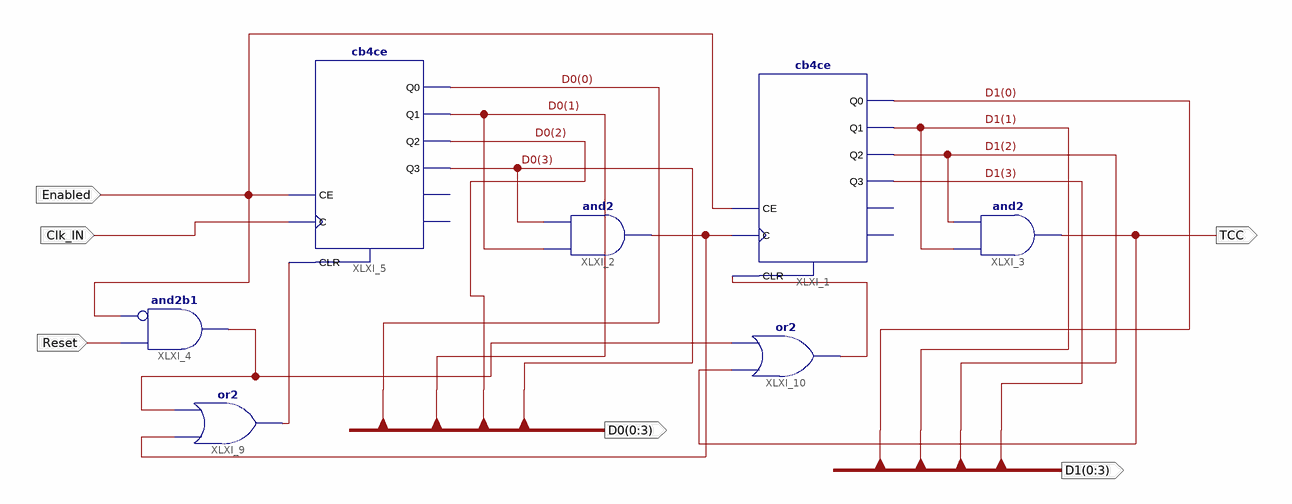
[diagram p0: schematic sheet 1]
// Xilinx ISE schematic Sec.sch (spartan6) as structural Verilog: 7 symbols, 6 ports
module Sec (
  input  Clk_IN,
  input  Enabled,
  input  Reset,
  output [0:3] D1,
  output TCC,
  output [0:3] D0
);

  wire TC, XLXN_23, XLXN_51;

  cb4ce XLXI_1 (
    .C(D0[0]), .CE(Enabled), .CLR(XLXN_51), .Q0(D1[0]), .Q1(D1[1]), .Q2(D1[2]), .Q3(D1[3]));  // open: CEO, TC
  and XLXI_2 (D0[0], D0[1], D0[3]);
  and XLXI_3 (TCC, D1[1], D1[2]);
  and XLXI_4 (XLXN_23, ~Enabled, Reset);  // and2b1
  cb4ce XLXI_5 (.C(Clk_IN), .CE(Enabled), .CLR(TC), .Q0(D0[0]), .Q1(D0[1]), .Q2(D0[2]), .Q3(D0[3]));  // open: CEO, TC
  or XLXI_9 (TC, D0[0], XLXN_23);
  or XLXI_10 (XLXN_51, TCC, XLXN_23);
endmodule
